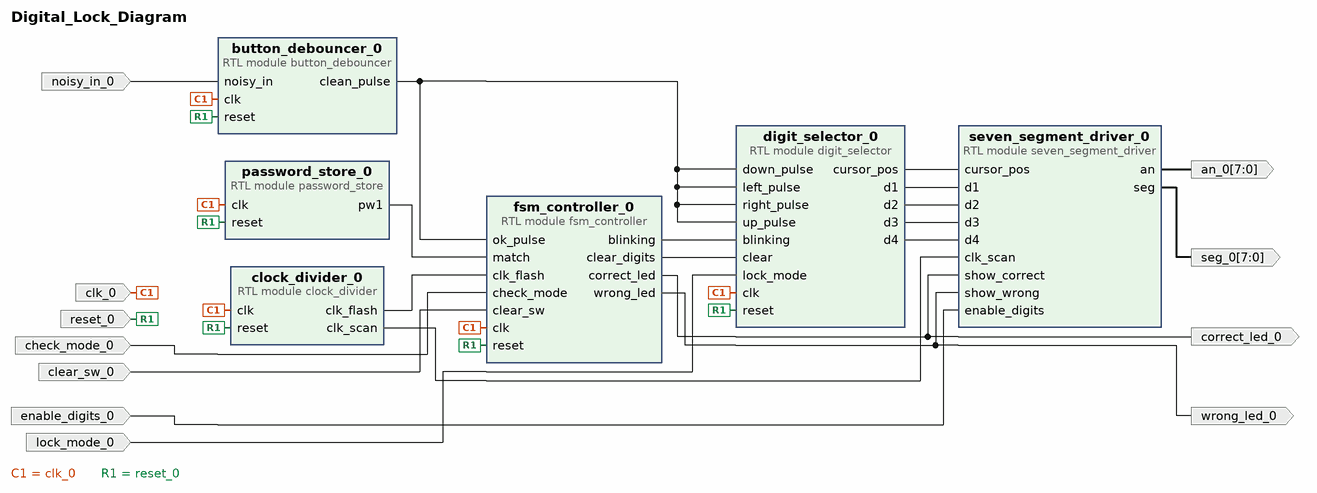
[diagram p0: block diagram of the top level]
# Vivado block design Digital_Lock_Diagram, xc7a100tcsg324-1, Vivado 2025.1
create_bd_design Digital_Lock_Diagram

create_bd_port -dir I -type clk clk_0
create_bd_port -dir I -type rst reset_0
create_bd_port -dir I noisy_in_0
create_bd_port -dir I lock_mode_0
create_bd_port -dir I check_mode_0
create_bd_port -dir I clear_sw_0
create_bd_port -dir O correct_led_0
create_bd_port -dir O wrong_led_0
create_bd_port -dir O -from 7 -to 0 seg_0
create_bd_port -dir O -from 7 -to 0 an_0
create_bd_port -dir I enable_digits_0

create_bd_cell -type module -reference button_debouncer button_debouncer_0
create_bd_cell -type module -reference seven_segment_driver seven_segment_driver_0
create_bd_cell -type module -reference clock_divider clock_divider_0
create_bd_cell -type module -reference fsm_controller fsm_controller_0
create_bd_cell -type module -reference password_store password_store_0
create_bd_cell -type module -reference digit_selector digit_selector_0

# ---- connections ----

connect_bd_net [get_bd_pins button_debouncer_0/clean_pulse] \
  [get_bd_pins digit_selector_0/up_pulse] [get_bd_pins digit_selector_0/down_pulse] [get_bd_pins digit_selector_0/left_pulse] \
  [get_bd_pins digit_selector_0/right_pulse] [get_bd_pins fsm_controller_0/ok_pulse]
connect_bd_net -net check_mode_0_1 [get_bd_ports check_mode_0] [get_bd_pins fsm_controller_0/check_mode]
connect_bd_net -net clear_sw_0_1 [get_bd_ports clear_sw_0] [get_bd_pins fsm_controller_0/clear_sw]
connect_bd_net -net clk_0_1 [get_bd_ports clk_0] \
  [get_bd_pins password_store_0/clk] [get_bd_pins digit_selector_0/clk] [get_bd_pins clock_divider_0/clk] \
  [get_bd_pins button_debouncer_0/clk] [get_bd_pins fsm_controller_0/clk]
connect_bd_net [get_bd_pins clock_divider_0/clk_flash] [get_bd_pins fsm_controller_0/clk_flash]
connect_bd_net [get_bd_pins clock_divider_0/clk_scan] [get_bd_pins seven_segment_driver_0/clk_scan]
connect_bd_net [get_bd_pins digit_selector_0/cursor_pos] [get_bd_pins seven_segment_driver_0/cursor_pos]
connect_bd_net [get_bd_pins digit_selector_0/d1] [get_bd_pins seven_segment_driver_0/d1]
connect_bd_net [get_bd_pins digit_selector_0/d2] [get_bd_pins seven_segment_driver_0/d2]
connect_bd_net [get_bd_pins digit_selector_0/d3] [get_bd_pins seven_segment_driver_0/d3]
connect_bd_net [get_bd_pins digit_selector_0/d4] [get_bd_pins seven_segment_driver_0/d4]
connect_bd_net -net enable_digits_0_1 [get_bd_ports enable_digits_0] [get_bd_pins seven_segment_driver_0/enable_digits]
connect_bd_net [get_bd_pins fsm_controller_0/blinking] [get_bd_pins digit_selector_0/blinking]
connect_bd_net [get_bd_pins fsm_controller_0/clear_digits] [get_bd_pins digit_selector_0/clear]
connect_bd_net [get_bd_pins fsm_controller_0/correct_led] [get_bd_ports correct_led_0] [get_bd_pins seven_segment_driver_0/show_correct]
connect_bd_net [get_bd_pins fsm_controller_0/wrong_led] [get_bd_ports wrong_led_0] [get_bd_pins seven_segment_driver_0/show_wrong]
connect_bd_net -net lock_mode_0_1 [get_bd_ports lock_mode_0] [get_bd_pins digit_selector_0/lock_mode]
connect_bd_net -net noisy_in_0_1 [get_bd_ports noisy_in_0] [get_bd_pins button_debouncer_0/noisy_in]
connect_bd_net [get_bd_pins password_store_0/pw1] [get_bd_pins fsm_controller_0/match]
connect_bd_net -net reset_0_1 [get_bd_ports reset_0] \
  [get_bd_pins digit_selector_0/reset] [get_bd_pins clock_divider_0/reset] [get_bd_pins button_debouncer_0/reset] \
  [get_bd_pins password_store_0/reset] [get_bd_pins fsm_controller_0/reset]
connect_bd_net [get_bd_pins seven_segment_driver_0/an] [get_bd_ports an_0]
connect_bd_net [get_bd_pins seven_segment_driver_0/seg] [get_bd_ports seg_0]

validate_bd_design
save_bd_design
